# EAGLE design receiver (EAGLE 7.2.0)

## Sheet 1 of 3: Connectors and Power Supply
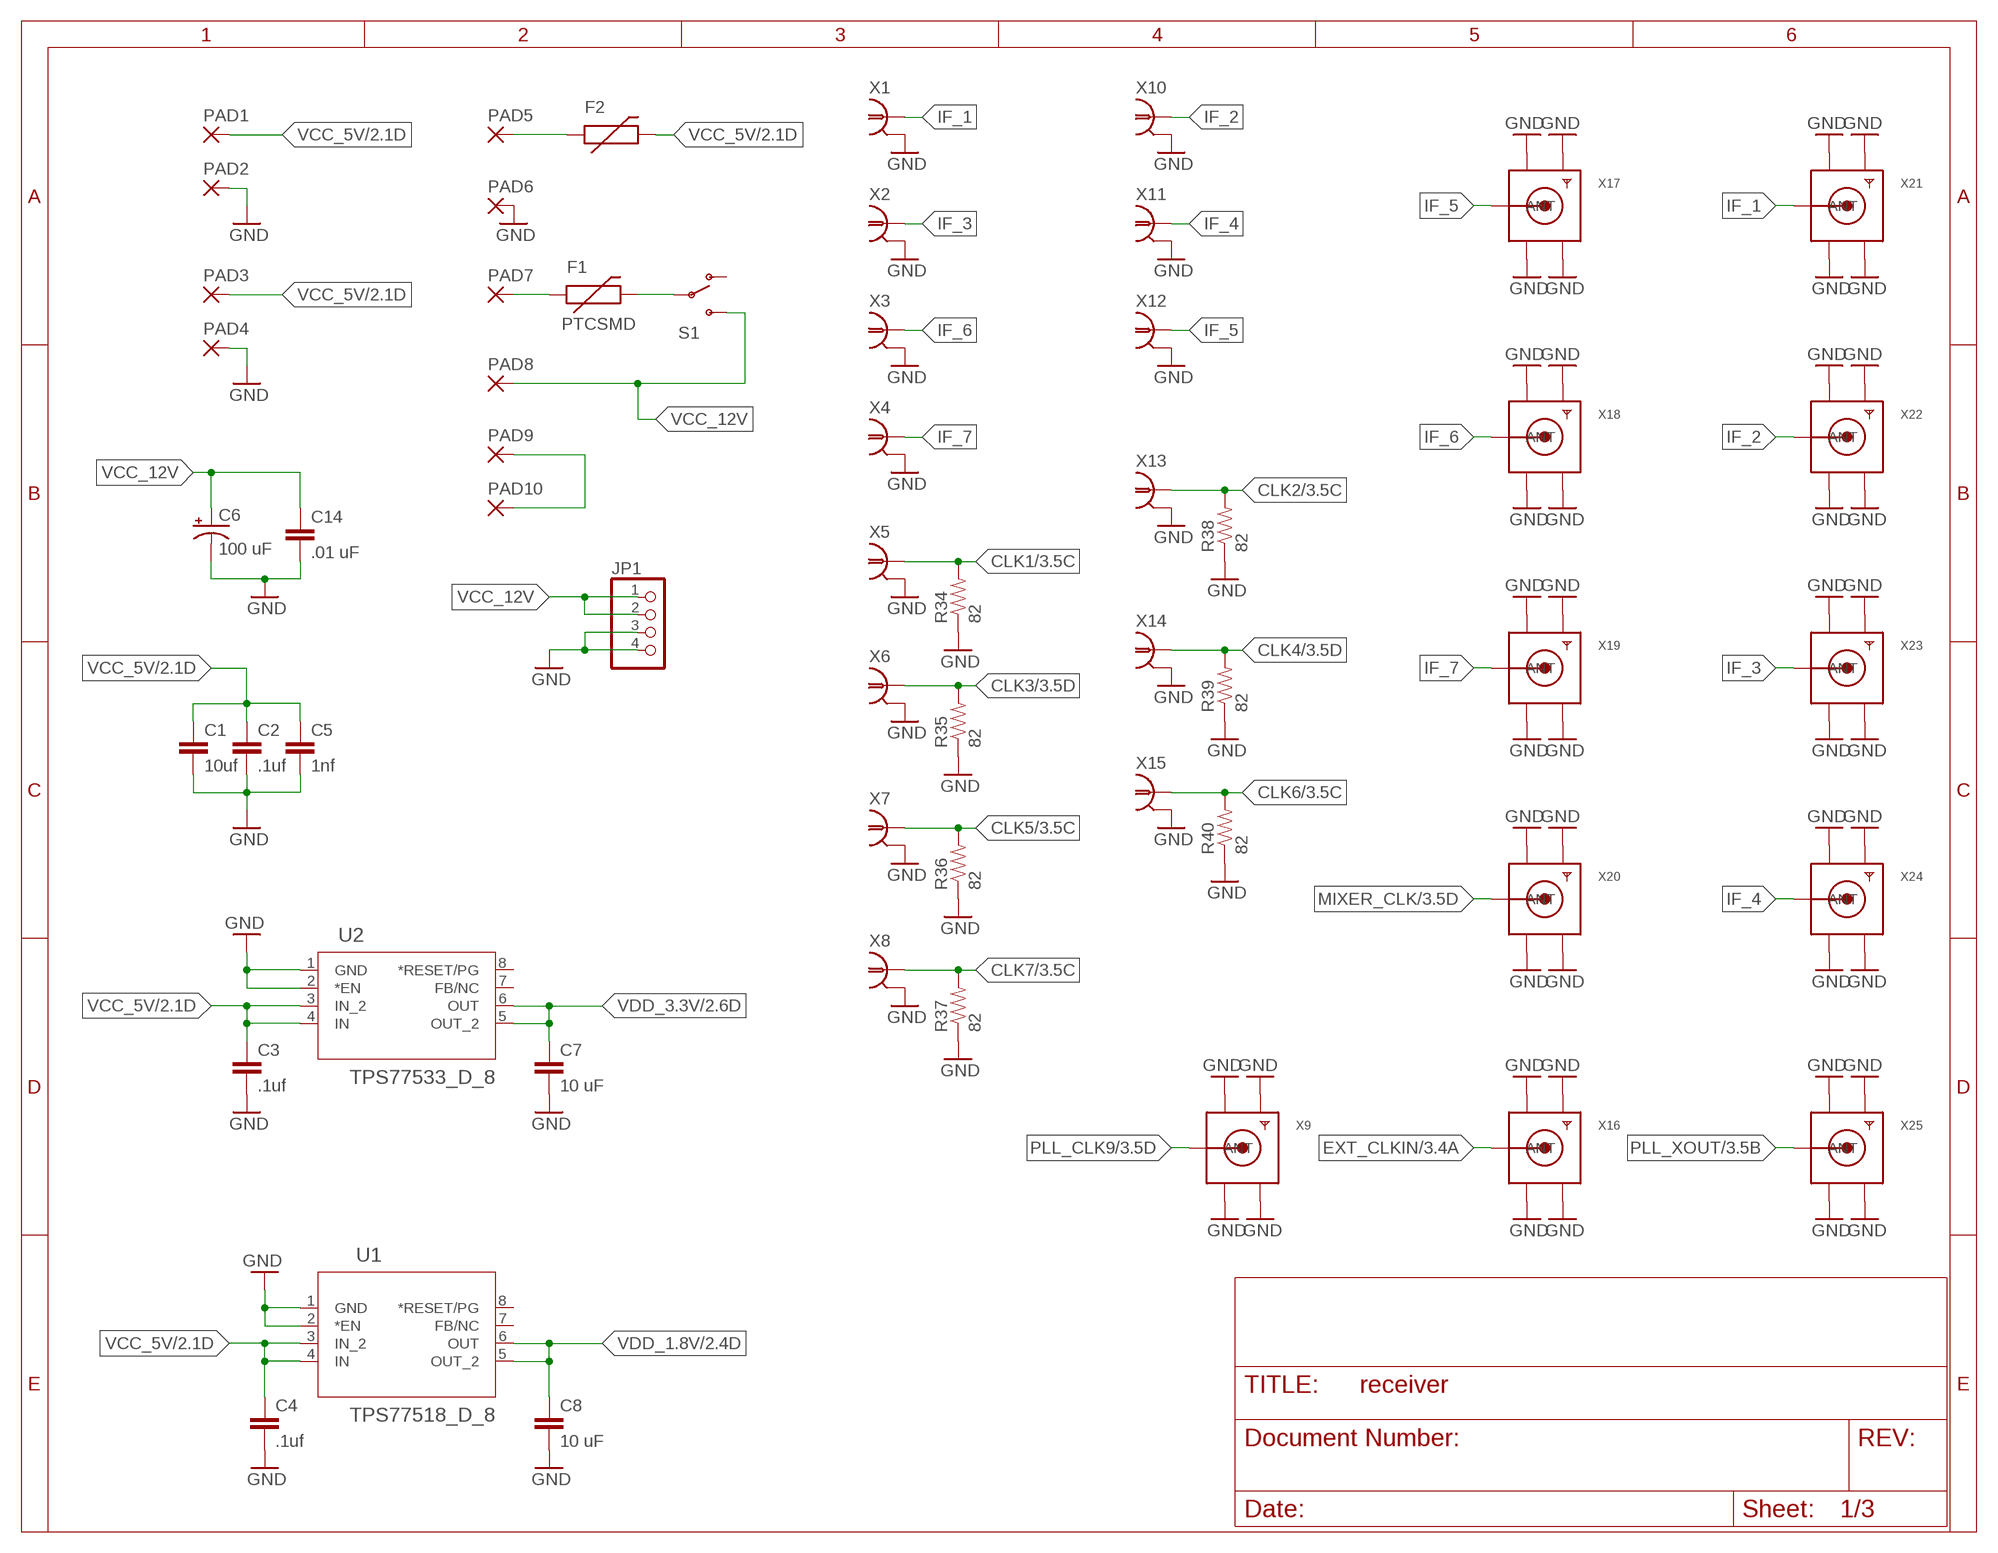
[diagram p0: schematic, sheet 1]

### Parts
C1  10uf  CAP1206  [1206]
C2  .1uf  CAP0805  [0805]
C3  .1uf  CAP0805  [0805]
C4  .1uf  CAP0805  [0805]
C5  1nf  CAP0805  [0805]
C6  100 uF  CAP_POLPTH4  [CPOL-RADIAL-1000UF-25V]
C7  10 uF  CAP1206  [1206]
C8  10 uF  CAP1206  [1206]
C14  .01 uF  CAP0805  [0805]
F1  PTCSMD  [PTC-1206]
F2  PTCSMD  [PTC-1206]
JP1  PINHD-1X4  [1X04]
PAD1  WIREPAD2,54/0,9  [2,54/0,9]
PAD2  WIREPAD2,54/0,9  [2,54/0,9]
PAD3  WIREPAD2,54/0,9  [2,54/0,9]
PAD4  WIREPAD2,54/0,9  [2,54/0,9]
PAD5  WIREPAD2,54/0,9  [2,54/0,9]
PAD6  WIREPAD2,54/0,9  [2,54/0,9]
PAD7  WIREPAD2,54/0,9  [2,54/0,9]
PAD8  WIREPAD2,54/0,9  [2,54/0,9]
PAD9  WIREPAD2,54/0,9  [2,54/0,9]
PAD10  WIREPAD2,54/0,9  [2,54/0,9]
R34  82  RESISTOR0805-RES  [0805]
R35  82  RESISTOR0805-RES  [0805]
R36  82  RESISTOR0805-RES  [0805]
R37  82  RESISTOR0805-RES  [0805]
R38  82  RESISTOR0805-RES  [0805]
R39  82  RESISTOR0805-RES  [0805]
R40  82  RESISTOR0805-RES  [0805]
S1  SWITCH-SPDTPTH  [SWITCH-SPDT]
U1  TPS77518_D_8  [D8]
U2  TPS77533_D_8  [D8]
X1  LTI-SASF54GT  [LTI-SASF54GT]
X2  LTI-SASF54GT  [LTI-SASF54GT]
X3  LTI-SASF54GT  [LTI-SASF54GT]
X4  LTI-SASF54GT  [LTI-SASF54GT]
X5  LTI-SASF54GT  [LTI-SASF54GT]
X6  LTI-SASF54GT  [LTI-SASF54GT]
X7  LTI-SASF54GT  [LTI-SASF54GT]
X8  LTI-SASF54GT  [LTI-SASF54GT]
X9  SMACONNECTOR_EDGE  [SMA_EDGELAUNCH]
X10  LTI-SASF54GT  [LTI-SASF54GT]
X11  LTI-SASF54GT  [LTI-SASF54GT]
X12  LTI-SASF54GT  [LTI-SASF54GT]
X13  LTI-SASF54GT  [LTI-SASF54GT]
X14  LTI-SASF54GT  [LTI-SASF54GT]
X15  LTI-SASF54GT  [LTI-SASF54GT]
X16  SMACONNECTOR_EDGE  [SMA_EDGELAUNCH]
X17  SMACONNECTOR_EDGE  [SMA_EDGELAUNCH]
X18  SMACONNECTOR_EDGE  [SMA_EDGELAUNCH]
X19  SMACONNECTOR_EDGE  [SMA_EDGELAUNCH]
X20  SMACONNECTOR_EDGE  [SMA_EDGELAUNCH]
X21  SMACONNECTOR_EDGE  [SMA_EDGELAUNCH]
X22  SMACONNECTOR_EDGE  [SMA_EDGELAUNCH]
X23  SMACONNECTOR_EDGE  [SMA_EDGELAUNCH]
X24  SMACONNECTOR_EDGE  [SMA_EDGELAUNCH]
X25  SMACONNECTOR_EDGE  [SMA_EDGELAUNCH]

### Nets
CLK1: R34.2 X5.1 ; also sheet 3
CLK2: R38.2 X13.1 ; also sheet 3
CLK3: R35.2 X6.1 ; also sheet 3
CLK4: R39.2 X14.1 ; also sheet 3
CLK5: R36.2 X7.1 ; also sheet 3
CLK6: R40.2 X15.1 ; also sheet 3
CLK7: R37.2 X8.1 ; also sheet 3
EXT_CLKIN: X16.P(ANT) ; also sheet 3
GND: C1.2 C2.2 C3.2 C4.2 C5.2 C6.- C7.2 C8.2 C14.2 JP1.3 JP1.4 PAD2.1(P) PAD4.1(P) PAD6.1(P) R34.1 R35.1 R36.1 R37.1 R38.1 R39.1 R40.1 U1.1(GND) U1.2(*EN) U2.1(GND) U2.2(*EN) X1.2 X1.3 X1.4 X1.5 X2.2 X2.3 X2.4 X2.5 X3.2 X3.3 X3.4 X3.5 X4.2 X4.3 X4.4 X4.5 X5.2 X5.3 X5.4 X5.5 X6.2 X6.3 X6.4 X6.5 X7.2 X7.3 X7.4 X7.5 X8.2 X8.3 X8.4 X8.5 X9.GND@1(GND4) X9.GND@2(GND3) X9.GND@3(GND2) X9.GND@4(GND1) X10.2 X10.3 X10.4 X10.5 X11.2 X11.3 X11.4 X11.5 X12.2 X12.3 X12.4 X12.5 X13.2 X13.3 X13.4 X13.5 X14.2 X14.3 X14.4 X14.5 X15.2 X15.3 X15.4 X15.5 X16.GND@1(GND4) X16.GND@2(GND3) X16.GND@3(GND2) X16.GND@4(GND1) X17.GND@1(GND4) X17.GND@2(GND3) X17.GND@3(GND2) X17.GND@4(GND1) X18.GND@1(GND4) X18.GND@2(GND3) X18.GND@3(GND2) X18.GND@4(GND1) X19.GND@1(GND4) X19.GND@2(GND3) X19.GND@3(GND2) X19.GND@4(GND1) X20.GND@1(GND4) X20.GND@2(GND3) X20.GND@3(GND2) X20.GND@4(GND1) X21.GND@1(GND4) X21.GND@2(GND3) X21.GND@3(GND2) X21.GND@4(GND1) X22.GND@1(GND4) X22.GND@2(GND3) X22.GND@3(GND2) X22.GND@4(GND1) X23.GND@1(GND4) X23.GND@2(GND3) X23.GND@3(GND2) X23.GND@4(GND1) X24.GND@1(GND4) X24.GND@2(GND3) X24.GND@3(GND2) X24.GND@4(GND1) X25.GND@1(GND4) X25.GND@2(GND3) X25.GND@3(GND2) X25.GND@4(GND1) ; also sheet 2,3
IF_1: X1.1 X21.P(ANT)
IF_2: X10.1 X22.P(ANT)
IF_3: X2.1 X23.P(ANT)
IF_4: X11.1 X24.P(ANT)
IF_5: X12.1 X17.P(ANT)
IF_6: X3.1 X18.P(ANT)
IF_7: X4.1 X19.P(ANT)
MIXER_CLK: X20.P(ANT) ; also sheet 3
N$3: F1.1 PAD7.1(P)
N$4: F1.2 S1.2(P)
N$7: F2.1 PAD5.1(P)
N$10: PAD9.1(P) PAD10.1(P)
PLL_CLK9: X9.P(ANT) ; also sheet 3
PLL_XOUT: X25.P(ANT) ; also sheet 3
VCC_5V: C1.1 C2.1 C3.1 C4.1 C5.1 F2.2 PAD1.1(P) PAD3.1(P) U1.3(IN_2) U1.4(IN) U2.3(IN_2) U2.4(IN) ; also sheet 2,3
VCC_12V: C6.+ C14.1 JP1.1 JP1.2 PAD8.1(P) S1.3(S)
VDD_1.8V: C8.1 U1.5(OUT_2) U1.6(OUT) ; also sheet 2,3
VDD_3.3V: C7.1 U2.5(OUT_2) U2.6(OUT) ; also sheet 2,3
Unconnected: S1.1(O) U1.7(FB/NC) U1.8(*RESET/PG) U2.7(FB/NC) U2.8(*RESET/PG)

## Sheet 2 of 3: GPIO, I2C Interfaces
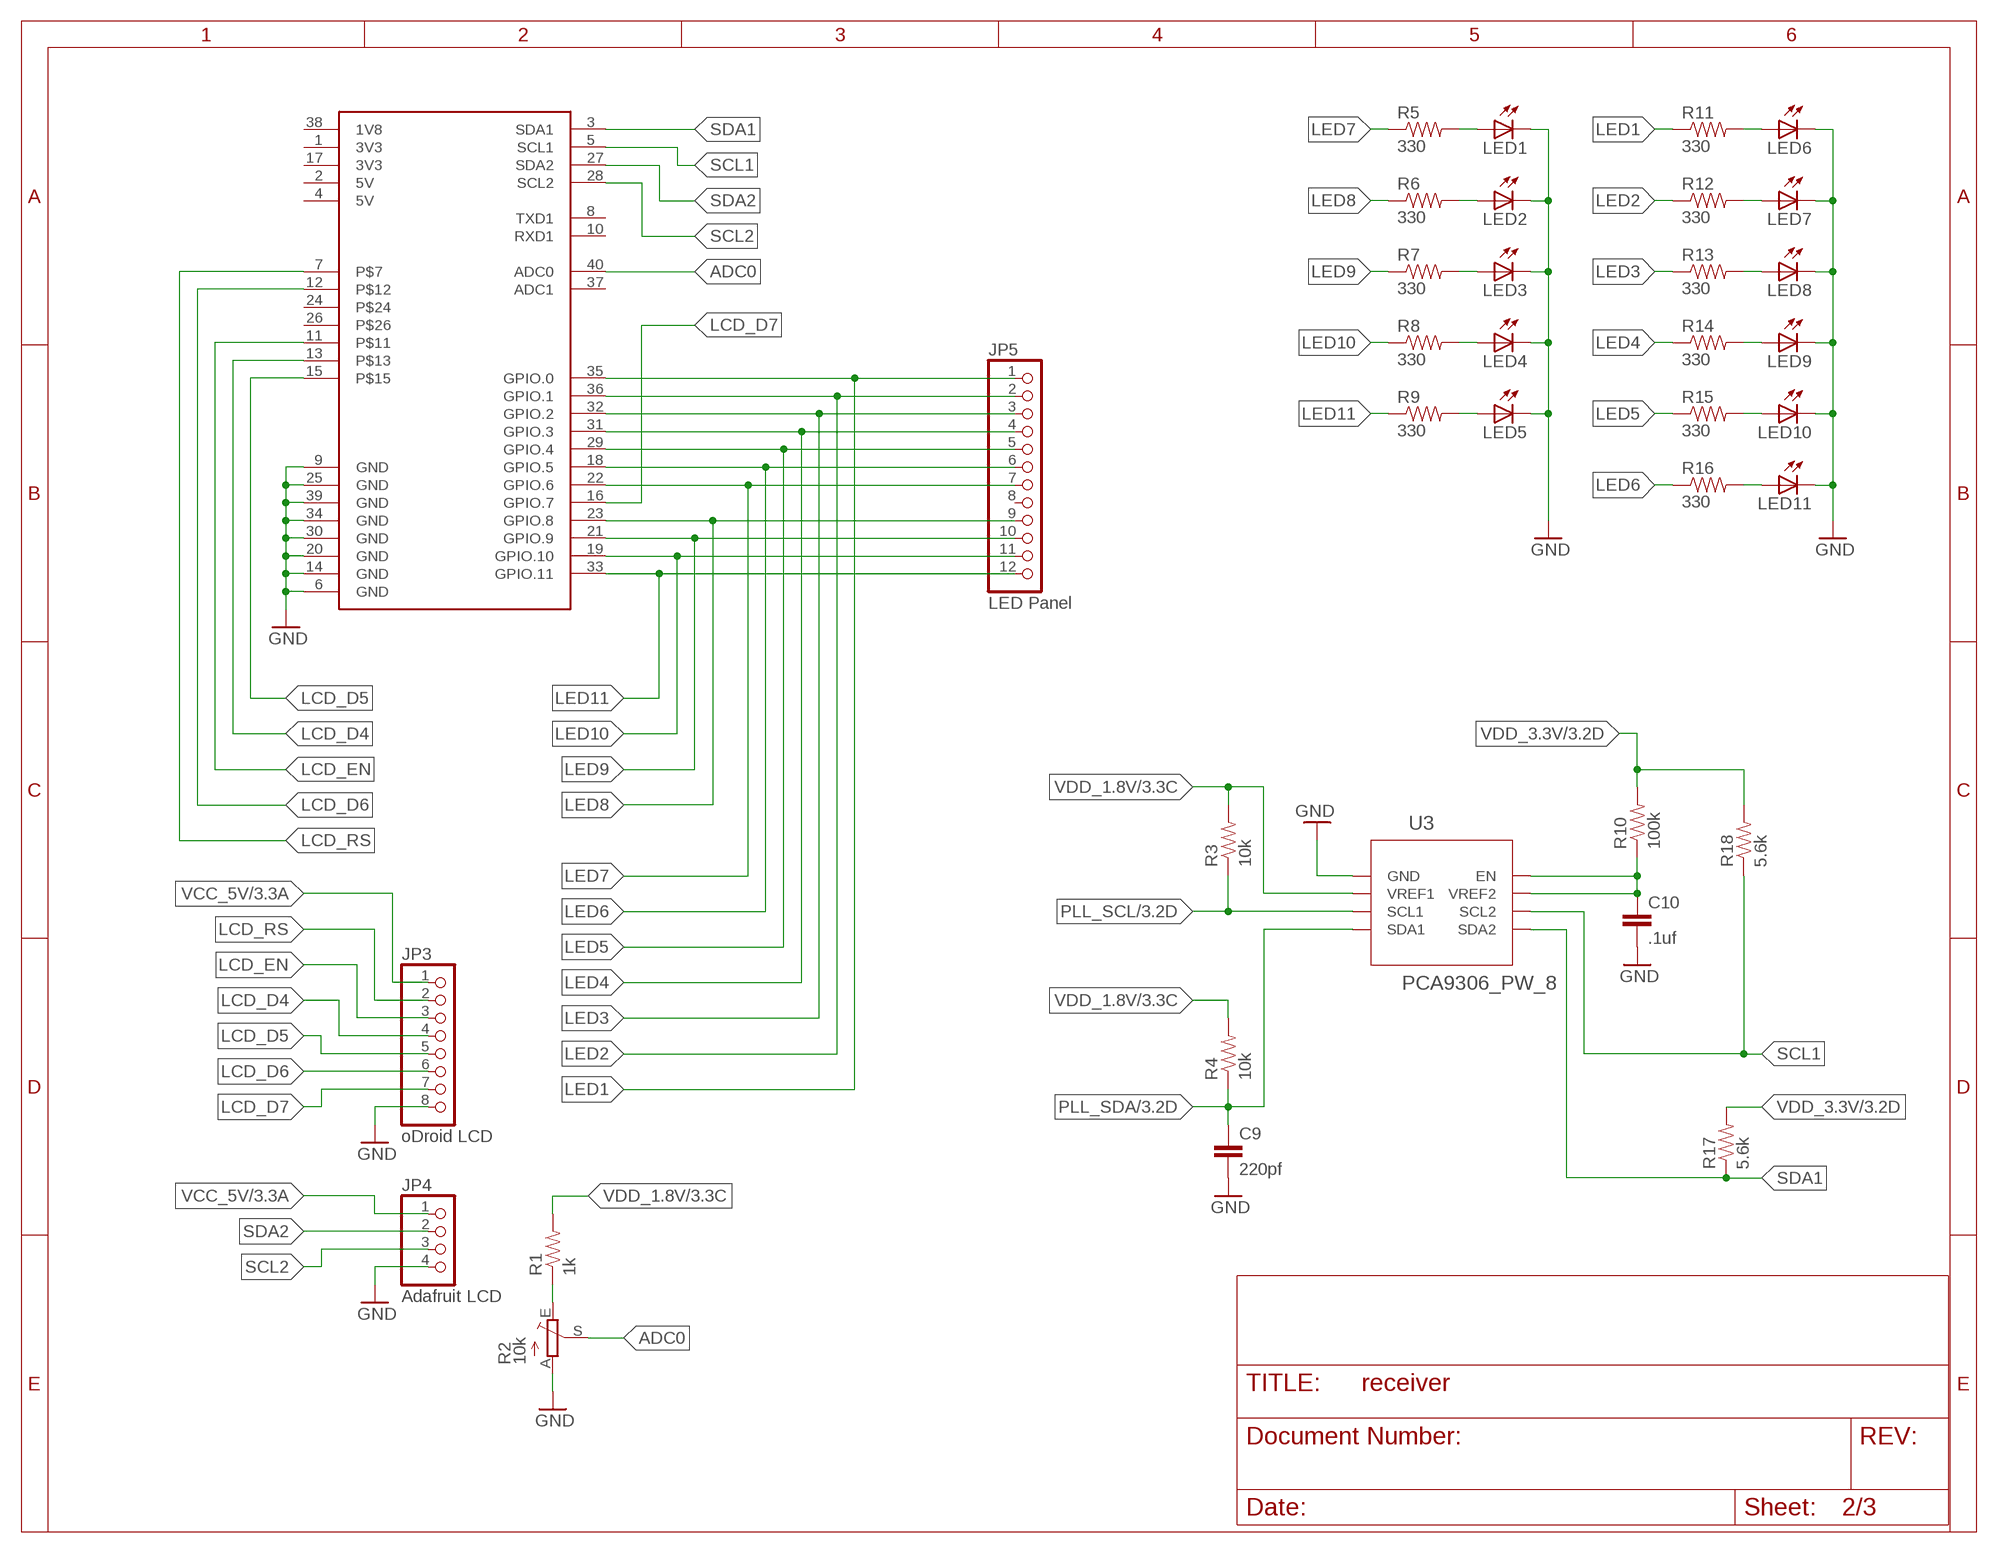
[diagram p1: schematic, sheet 2]

### Parts
C9  220pf  CAP0805  [0805]
C10  .1uf  CAP0805  [0805]
JP2  C1_GPIO  [2X20-BIG]
JP3  oDroid LCD  PINHD-1X8  [1X08]
JP4  Adafruit LCD  PINHD-1X4  [1X04]
JP5  LED Panel  PINHD-1X12  [1X12]
LED1  LEDCHIPLED_1206  [CHIPLED_1206]
LED2  LEDCHIPLED_1206  [CHIPLED_1206]
LED3  LEDCHIPLED_1206  [CHIPLED_1206]
LED4  LEDCHIPLED_1206  [CHIPLED_1206]
LED5  LEDCHIPLED_1206  [CHIPLED_1206]
LED6  LEDCHIPLED_1206  [CHIPLED_1206]
LED7  LEDCHIPLED_1206  [CHIPLED_1206]
LED8  LEDCHIPLED_1206  [CHIPLED_1206]
LED9  LEDCHIPLED_1206  [CHIPLED_1206]
LED10  LEDCHIPLED_1206  [CHIPLED_1206]
LED11  LEDCHIPLED_1206  [CHIPLED_1206]
R1  1k  RESISTOR0805-RES  [0805]
R2  10k  TRIM_EU-B64Y  [B64Y]
R3  10k  RESISTOR0805-RES  [0805]
R4  10k  RESISTOR0805-RES  [0805]
R5  330  RESISTOR0805-RES  [0805]
R6  330  RESISTOR0805-RES  [0805]
R7  330  RESISTOR0805-RES  [0805]
R8  330  RESISTOR0805-RES  [0805]
R9  330  RESISTOR0805-RES  [0805]
R10  100k  RESISTOR0805-RES  [0805]
R11  330  RESISTOR0805-RES  [0805]
R12  330  RESISTOR0805-RES  [0805]
R13  330  RESISTOR0805-RES  [0805]
R14  330  RESISTOR0805-RES  [0805]
R15  330  RESISTOR0805-RES  [0805]
R16  330  RESISTOR0805-RES  [0805]
R17  5.6k  RESISTOR0805-RES  [0805]
R18  5.6k  RESISTOR0805-RES  [0805]
U3  PCA9306_PW_8  [PW8]

### Nets
ADC0: JP2.40(ADC0) R2.S
GND: C9.2 C10.2 JP2.6(GND) JP2.9(GND) JP2.14(GND) JP2.20(GND) JP2.25(GND) JP2.30(GND) JP2.34(GND) JP2.39(GND) JP3.8 JP4.4 LED1.C LED2.C LED3.C LED4.C LED5.C LED6.C LED7.C LED8.C LED9.C LED10.C LED11.C R2.A U3.1(GND) ; also sheet 1,3
LCD_D4: JP2.13 JP3.4
LCD_D5: JP2.15 JP3.5
LCD_D6: JP2.12 JP3.6
LCD_D7: JP2.16(GPIO.7) JP3.7
LCD_EN: JP2.11 JP3.3
LCD_RS: JP2.7 JP3.2
LED1: JP2.35(GPIO.0) JP5.1 R11.1
LED2: JP2.36(GPIO.1) JP5.2 R12.1
LED3: JP2.32(GPIO.2) JP5.3 R13.1
LED4: JP2.31(GPIO.3) JP5.4 R14.1
LED5: JP2.29(GPIO.4) JP5.5 R15.1
LED6: JP2.18(GPIO.5) JP5.6 R16.1
LED7: JP2.22(GPIO.6) JP5.7 R5.1
LED8: JP2.23(GPIO.8) JP5.9 R6.1
LED9: JP2.21(GPIO.9) JP5.10 R7.1
LED10: JP2.19(GPIO.10) JP5.11 R8.1
LED11: JP2.33(GPIO.11) JP5.12 R9.1
N$2: C10.1 R10.1 U3.7(VREF2) U3.8(EN)
N$8: R1.1 R2.E
N$19: LED5.A R9.2
N$20: LED4.A R8.2
N$21: LED3.A R7.2
N$22: LED2.A R6.2
N$23: LED1.A R5.2
N$24: LED11.A R16.2
N$30: LED10.A R15.2
N$33: LED9.A R14.2
N$34: LED8.A R13.2
N$35: LED7.A R12.2
N$36: LED6.A R11.2
PLL_SCL: R3.1 U3.3(SCL1) ; also sheet 3
PLL_SDA: C9.1 R4.1 U3.4(SDA1) ; also sheet 3
SCL1: JP2.5(SCL1) R18.1 U3.6(SCL2)
SCL2: JP2.28(SCL2) JP4.3
SDA1: JP2.3(SDA1) R17.1 U3.5(SDA2)
SDA2: JP2.27(SDA2) JP4.2
VCC_5V: JP3.1 JP4.1 ; also sheet 1,3
VDD_1.8V: R1.2 R3.2 R4.2 U3.2(VREF1) ; also sheet 1,3
VDD_3.3V: R10.2 R17.2 R18.2 ; also sheet 1,3
Unconnected: JP2.1(3V3) JP2.2(5V) JP2.4(5V) JP2.8(TXD1) JP2.10(RXD1) JP2.17(3V3) JP2.24 JP2.26 JP2.37(ADC1) JP2.38(1V8) JP5.8

## Sheet 3 of 3: PLL
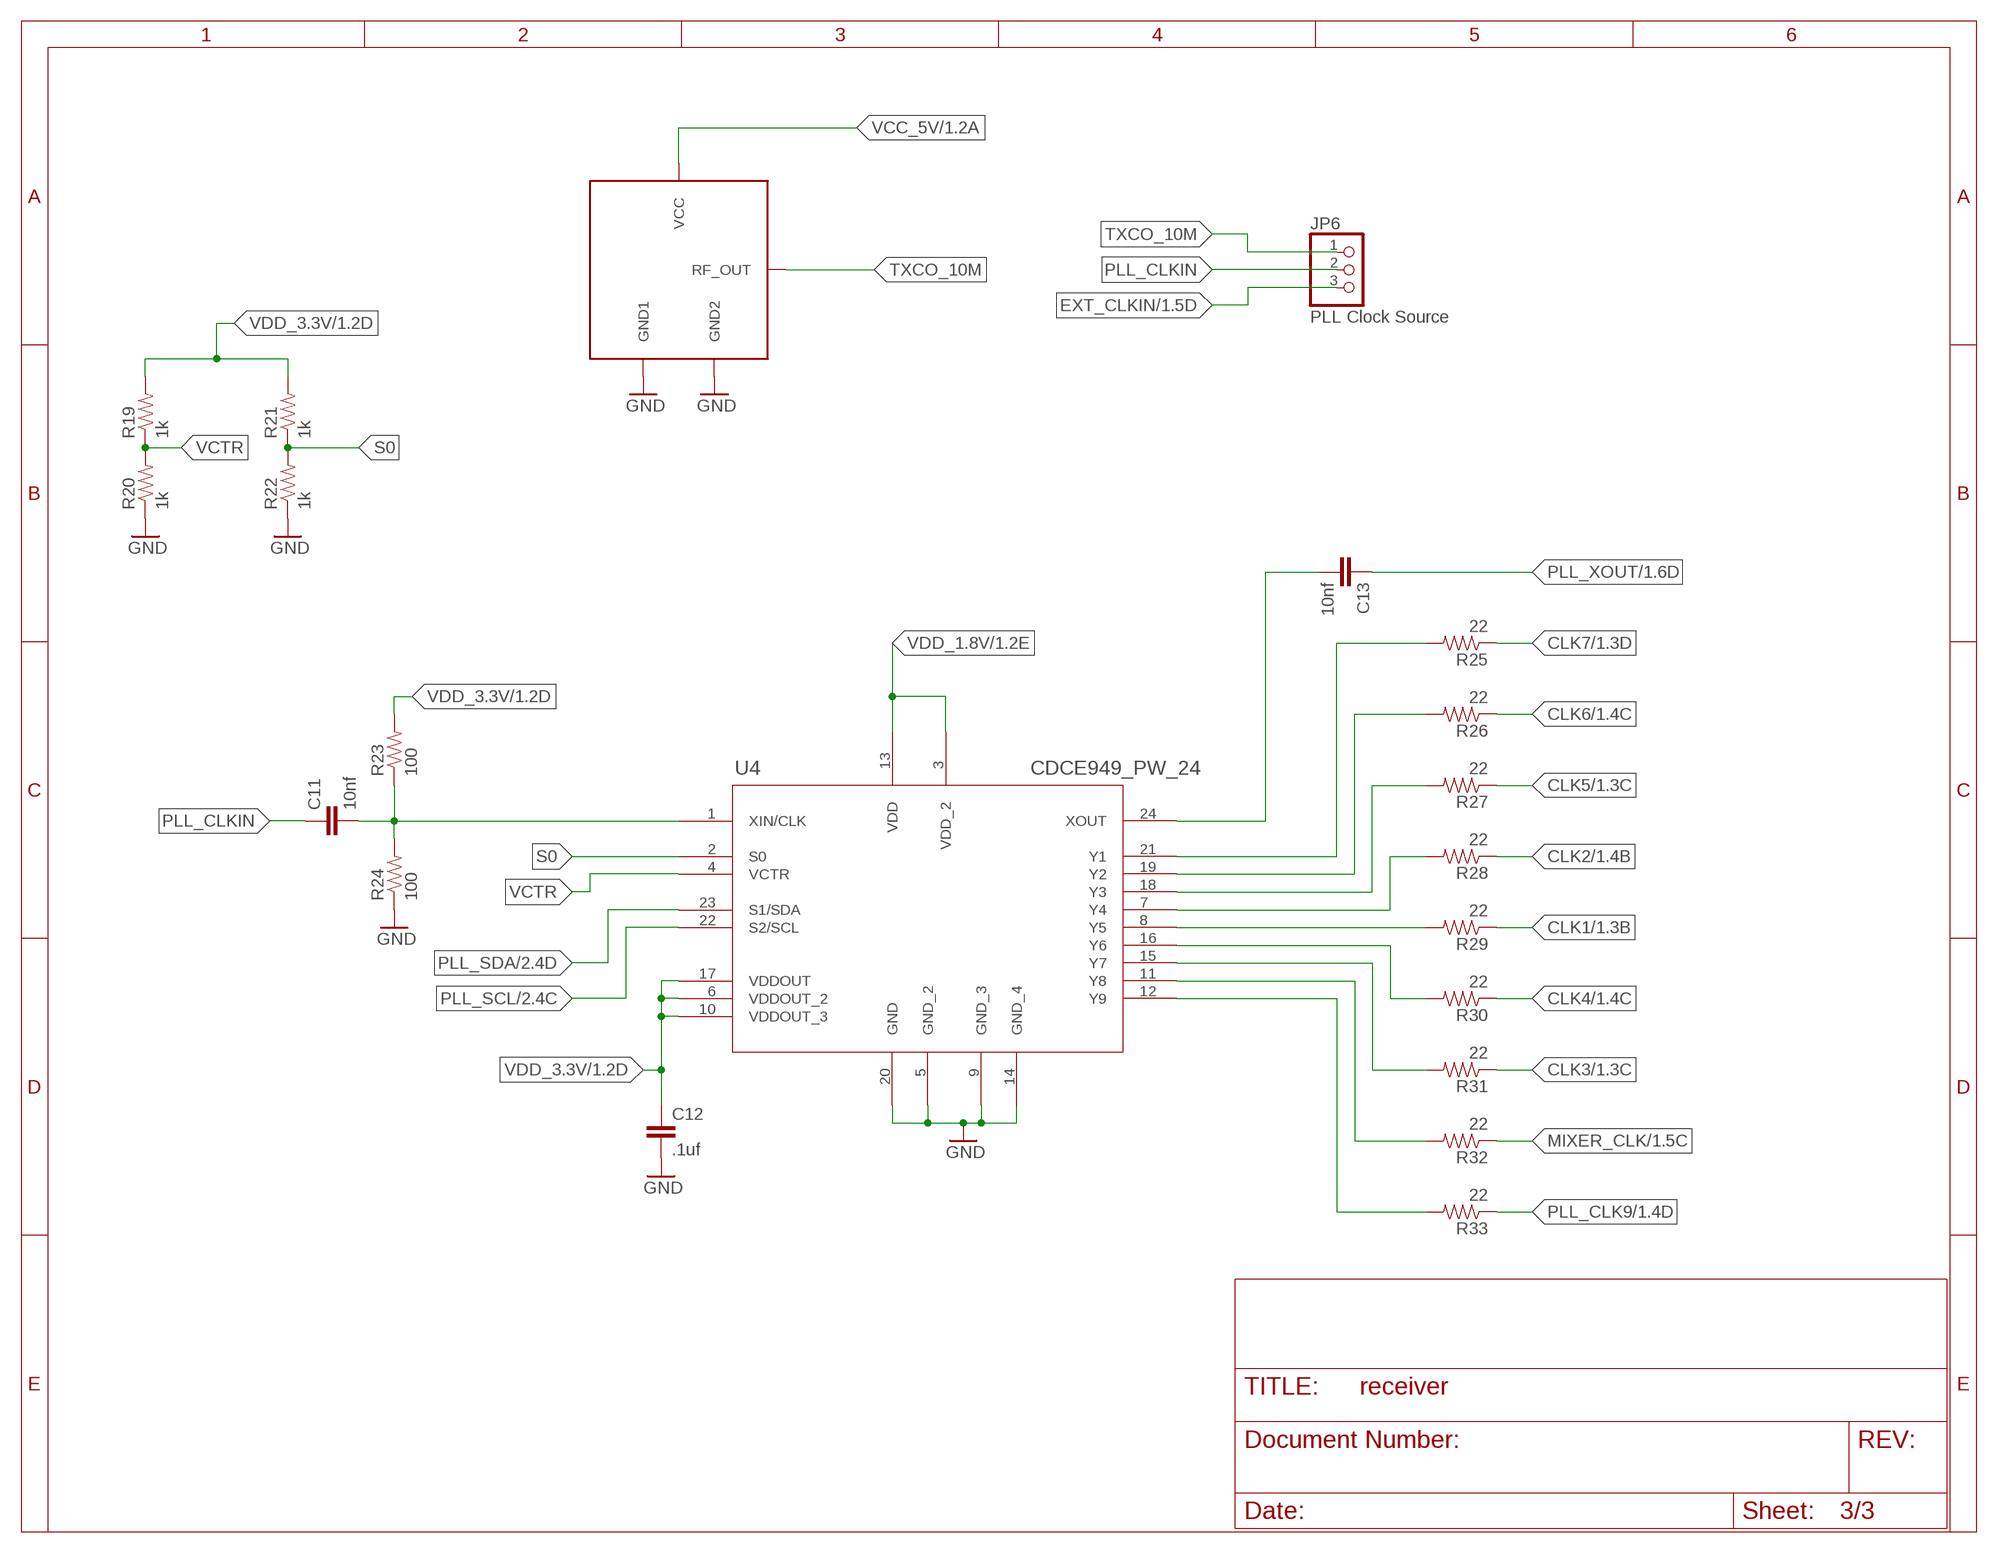
[diagram p2: schematic, sheet 3]

### Parts
$3_194_$_2015-06-18_19-54-36  TXCO 10M  TCXO-10MTHRU-HOLE  [THRU-HOLE]
C11  10nf  CAP0805  [0805]
C12  .1uf  CAP0805  [0805]
C13  10nf  CAP0805  [0805]
JP6  PLL Clock Source  PINHD-1X3  [1X03]
R19  1k  RESISTOR0805-RES  [0805]
R20  1k  RESISTOR0805-RES  [0805]
R21  1k  RESISTOR0805-RES  [0805]
R22  1k  RESISTOR0805-RES  [0805]
R23  100  RESISTOR0805-RES  [0805]
R24  100  RESISTOR0805-RES  [0805]
R25  22  RESISTOR0805-RES  [0805]
R26  22  RESISTOR0805-RES  [0805]
R27  22  RESISTOR0805-RES  [0805]
R28  22  RESISTOR0805-RES  [0805]
R29  22  RESISTOR0805-RES  [0805]
R30  22  RESISTOR0805-RES  [0805]
R31  22  RESISTOR0805-RES  [0805]
R32  22  RESISTOR0805-RES  [0805]
R33  22  RESISTOR0805-RES  [0805]
U4  CDCE949_PW_24  [PW24]

### Nets
CLK1: R29.1 ; also sheet 1
CLK2: R28.1 ; also sheet 1
CLK3: R31.1 ; also sheet 1
CLK4: R30.1 ; also sheet 1
CLK5: R27.1 ; also sheet 1
CLK6: R26.1 ; also sheet 1
CLK7: R25.1 ; also sheet 1
EXT_CLKIN: JP6.3 ; also sheet 1
GND: $3_194_$_2015-06-18_19-54-36.GND1 $3_194_$_2015-06-18_19-54-36.GND2 C12.2 R20.1 R22.1 R24.1 U4.5(GND_2) U4.9(GND_3) U4.14(GND_4) U4.20(GND) ; also sheet 1,2
MIXER_CLK: R32.1 ; also sheet 1
N$1: C11.2 R23.1 R24.2 U4.1(XIN/CLK)
N$6: C13.2 U4.24(XOUT)
N$12: R31.2 U4.15(Y7)
N$17: R25.2 U4.21(Y1)
N$25: R26.2 U4.19(Y2)
N$26: R27.2 U4.18(Y3)
N$27: R28.2 U4.7(Y4)
N$28: R29.2 U4.8(Y5)
N$29: R30.2 U4.16(Y6)
N$31: R32.2 U4.11(Y8)
N$32: R33.2 U4.12(Y9)
PLL_CLK9: R33.1 ; also sheet 1
PLL_CLKIN: C11.1 JP6.2
PLL_SCL: U4.22(S2/SCL) ; also sheet 2
PLL_SDA: U4.23(S1/SDA) ; also sheet 2
PLL_XOUT: C13.1 ; also sheet 1
S0: R21.1 R22.2 U4.2(S0)
TXCO_10M: $3_194_$_2015-06-18_19-54-36.RF_OUT JP6.1
VCC_5V: $3_194_$_2015-06-18_19-54-36.VCC ; also sheet 1,2
VCTR: R19.1 R20.2 U4.4(VCTR)
VDD_1.8V: U4.3(VDD_2) U4.13(VDD) ; also sheet 1,2
VDD_3.3V: C12.1 R19.2 R21.2 R23.2 U4.6(VDDOUT_2) U4.10(VDDOUT_3) U4.17(VDDOUT) ; also sheet 1,2

## Library data of the parts
$3_194_$_2015-06-18_19-54-36 = crystek-tcxo:TCXO-10M
C1-C5 C7-C14 = SparkFun-Capacitors:CAP: Capacitor Standard 0603 ceramic capacitor, and 0.1" leaded capacitor.
C6 = SparkFun-Capacitors:CAP_POL: Capacitor Polarized These are standard SMD and PTH capacitors. Normally 10uF, 47uF, and 100uF in electrolytic and tantalum varieties. Always verify the external diameter of the through hole cap, it varies with capacity, voltage, and manufacturer. The EIA devices should be standard.
F1 F2 = SparkFun-PowerIC:PTC: Resettable Fuse PTC Resettable Fuse. Spark Fun Electronics SKU : COM-08357; PROD_ID: RES-11150
JP1 JP4 = pinhead:PINHD-1X4: PIN HEADER
JP2 = odroid-dt:C1_GPIO
JP3 = pinhead:PINHD-1X8: PIN HEADER
JP5 = adafruit:PINHD-1X12: PIN HEADER
JP6 = pinhead:PINHD-1X3: PIN HEADER
LED1-LED11 = adafruit:LED: LED OSRAM: - CHIPLED LG R971, LG N971, LY N971, LG Q971, LY Q971, LO R971, LY R971 LH N974, LH R974 LS Q976, LO Q976, LY Q976 LO Q996 - Hyper CHIPLED LW Q18S LB Q993, LB Q99A, LB R99A - SideLED LS A670, LO A670, LY A670, LG A670, LP A670 LB A673, LV A673, LT A673, LW A673 LH A674 LY A675 LS A676, LA A676, LO A676, LY A676, LW A676 LS A679, LY A679, LG A679 - Hyper Micro SIDELED® LS Y876, LA Y876, LO Y876, LY Y876 LT Y87S - SmartLED LW L88C, LW L88S LB L89C, LB L89S, LG L890 LS L89K, LO L89K, LY L89K LS L896, LA L896, LO L896, LY L896 - TOPLED LS T670, LO T670, LY T670, LG T670, LP T670 LSG T670, LSP T670, LSY T670, LOP T670, LYG T670 LG T671, LOG T671, LSG T671 LB T673, LV T673, LT T673, LW T673 LH T674 LS T676, LA T676, LO T676, LY T676, LB T676, LH T676, LSB T676, LW T676 LB T67C, LV T67C, LT T67C, LS T67K, LO T67K, LY T67K, LW E67C LS E67B, LA E67B, LO E67B, LY E67B, LB E67C, LV E67C, LT E67C LW T67C LS T679, LY T679, LG T679 LS T770, LO T770, LY T770, LG T770, LP T770 LB T773, LV T773, LT T773, LW T773 LH T774 LS E675, LA E675, LY E675, LS T675 LS T776, LA T776, LO T776, LY T776, LB T776 LHGB T686 LT T68C, LB T68C - Hyper Mini TOPLED® LB M676 - Mini TOPLED Santana® LG M470 LS M47K, LO M47K, LY M47K Source: http://www.osram.convergy.de/
PAD1-PAD10 = wirepad:WIREPAD: Wire PAD connect wire on PCB
R1 R3-R40 = SparkFun-Passives:RESISTOR: Resistor Basic schematic elements and footprints for 0603, 1206, and PTH resistors.
R2 = pot:TRIM_EU-: POTENTIOMETER
S1 = SparkFun-Electromechanical:SWITCH-SPDT: SPDT Switch Simple slide switch, Spark Fun Electronics SKU : COM-00102 DPDT SMT slide switch, AYZ0202, SWCH-08179; PROD_ID: SWCH-08261
U1 = ti-pwr18-dt:TPS77518_D_8; DATASHEETURL: http://www.ti.com/lit/gpn/TPS77518; DESCRIPTION: Single Output LDO, 500mA, Fixed(1.8V), Fast Transient Response, SVS; FAMILY_NAME: SINGLE CHANNEL LDO; GENERIC_PART_NUMBER: TPS77518; INDUSTRY_STD_PKG_TYPE: SOIC; MANUFACTURER: Texas Instruments; MANUFACTURER_PART_NUMBER: tps77518_d_8; PACKAGE_DESIGNATOR: D; PIN_COUNT: 8; VENDOR: Texas Instruments
U2 = ti-pwr-dt:TPS77533_D_8; DATASHEETURL: http://www.ti.com/lit/gpn/TPS77533; DESCRIPTION: Single Output LDO, 500mA, Fixed(3.3V), Fast Transient Response, SVS; FAMILY_NAME: SINGLE CHANNEL LDO; GENERIC_PART_NUMBER: TPS77533; INDUSTRY_STD_PKG_TYPE: SOIC; MANUFACTURER: Texas Instruments; MANUFACTURER_PART_NUMBER: tps77533_d_8; PACKAGE_DESIGNATOR: D; PIN_COUNT: 8; VENDOR: Texas Instruments
U3 = ti-i2c:PCA9306_PW_8; DATASHEETURL: http://www.ti.com/lit/gpn/PCA9306; DESCRIPTION: Dual Bi-Directional I2C-Bus and SMBus Voltage Level-Translator; FAMILY_NAME: I2C SPECIAL FUNCTION; GENERIC_PART_NUMBER: PCA9306; INDUSTRY_STD_PKG_TYPE: TSSOP; MANUFACTURER: Texas Instruments; MANUFACTURER_PART_NUMBER: pca9306_pw_8; PACKAGE_DESIGNATOR: PW; PIN_COUNT: 8; VENDOR: Texas Instruments
U4 = ti-pll:CDCE949_PW_24; DATASHEETURL: http://www.ti.com/lit/gpn/CDCE949; DESCRIPTION: Programmable 4-PLL VCXO Clock Synthesizer with 2.5V or 3.3V LVCMOS Outputs; FAMILY_NAME: VCXO INPUT; GENERIC_PART_NUMBER: CDCE949; INDUSTRY_STD_PKG_TYPE: TSSOP; MANUFACTURER: Texas Instruments; PACKAGE_DESIGNATOR: PW; PIN_COUNT: 24
X1-X8 X10-X15 = con-coax:LTI-SASF54GT: SMA vertical PCB thrue hole jack Source: Lighthorse Technologies, inc. SASF54GT.pdf; OC_FARNELL: unknown; OC_NEWARK: unknown
X9 X16-X25 = adafruit:SMACONNECTOR: SMA Connector 90° DIP SMA Connector, 50 Ohm (4UConnector: 07259)

## Board
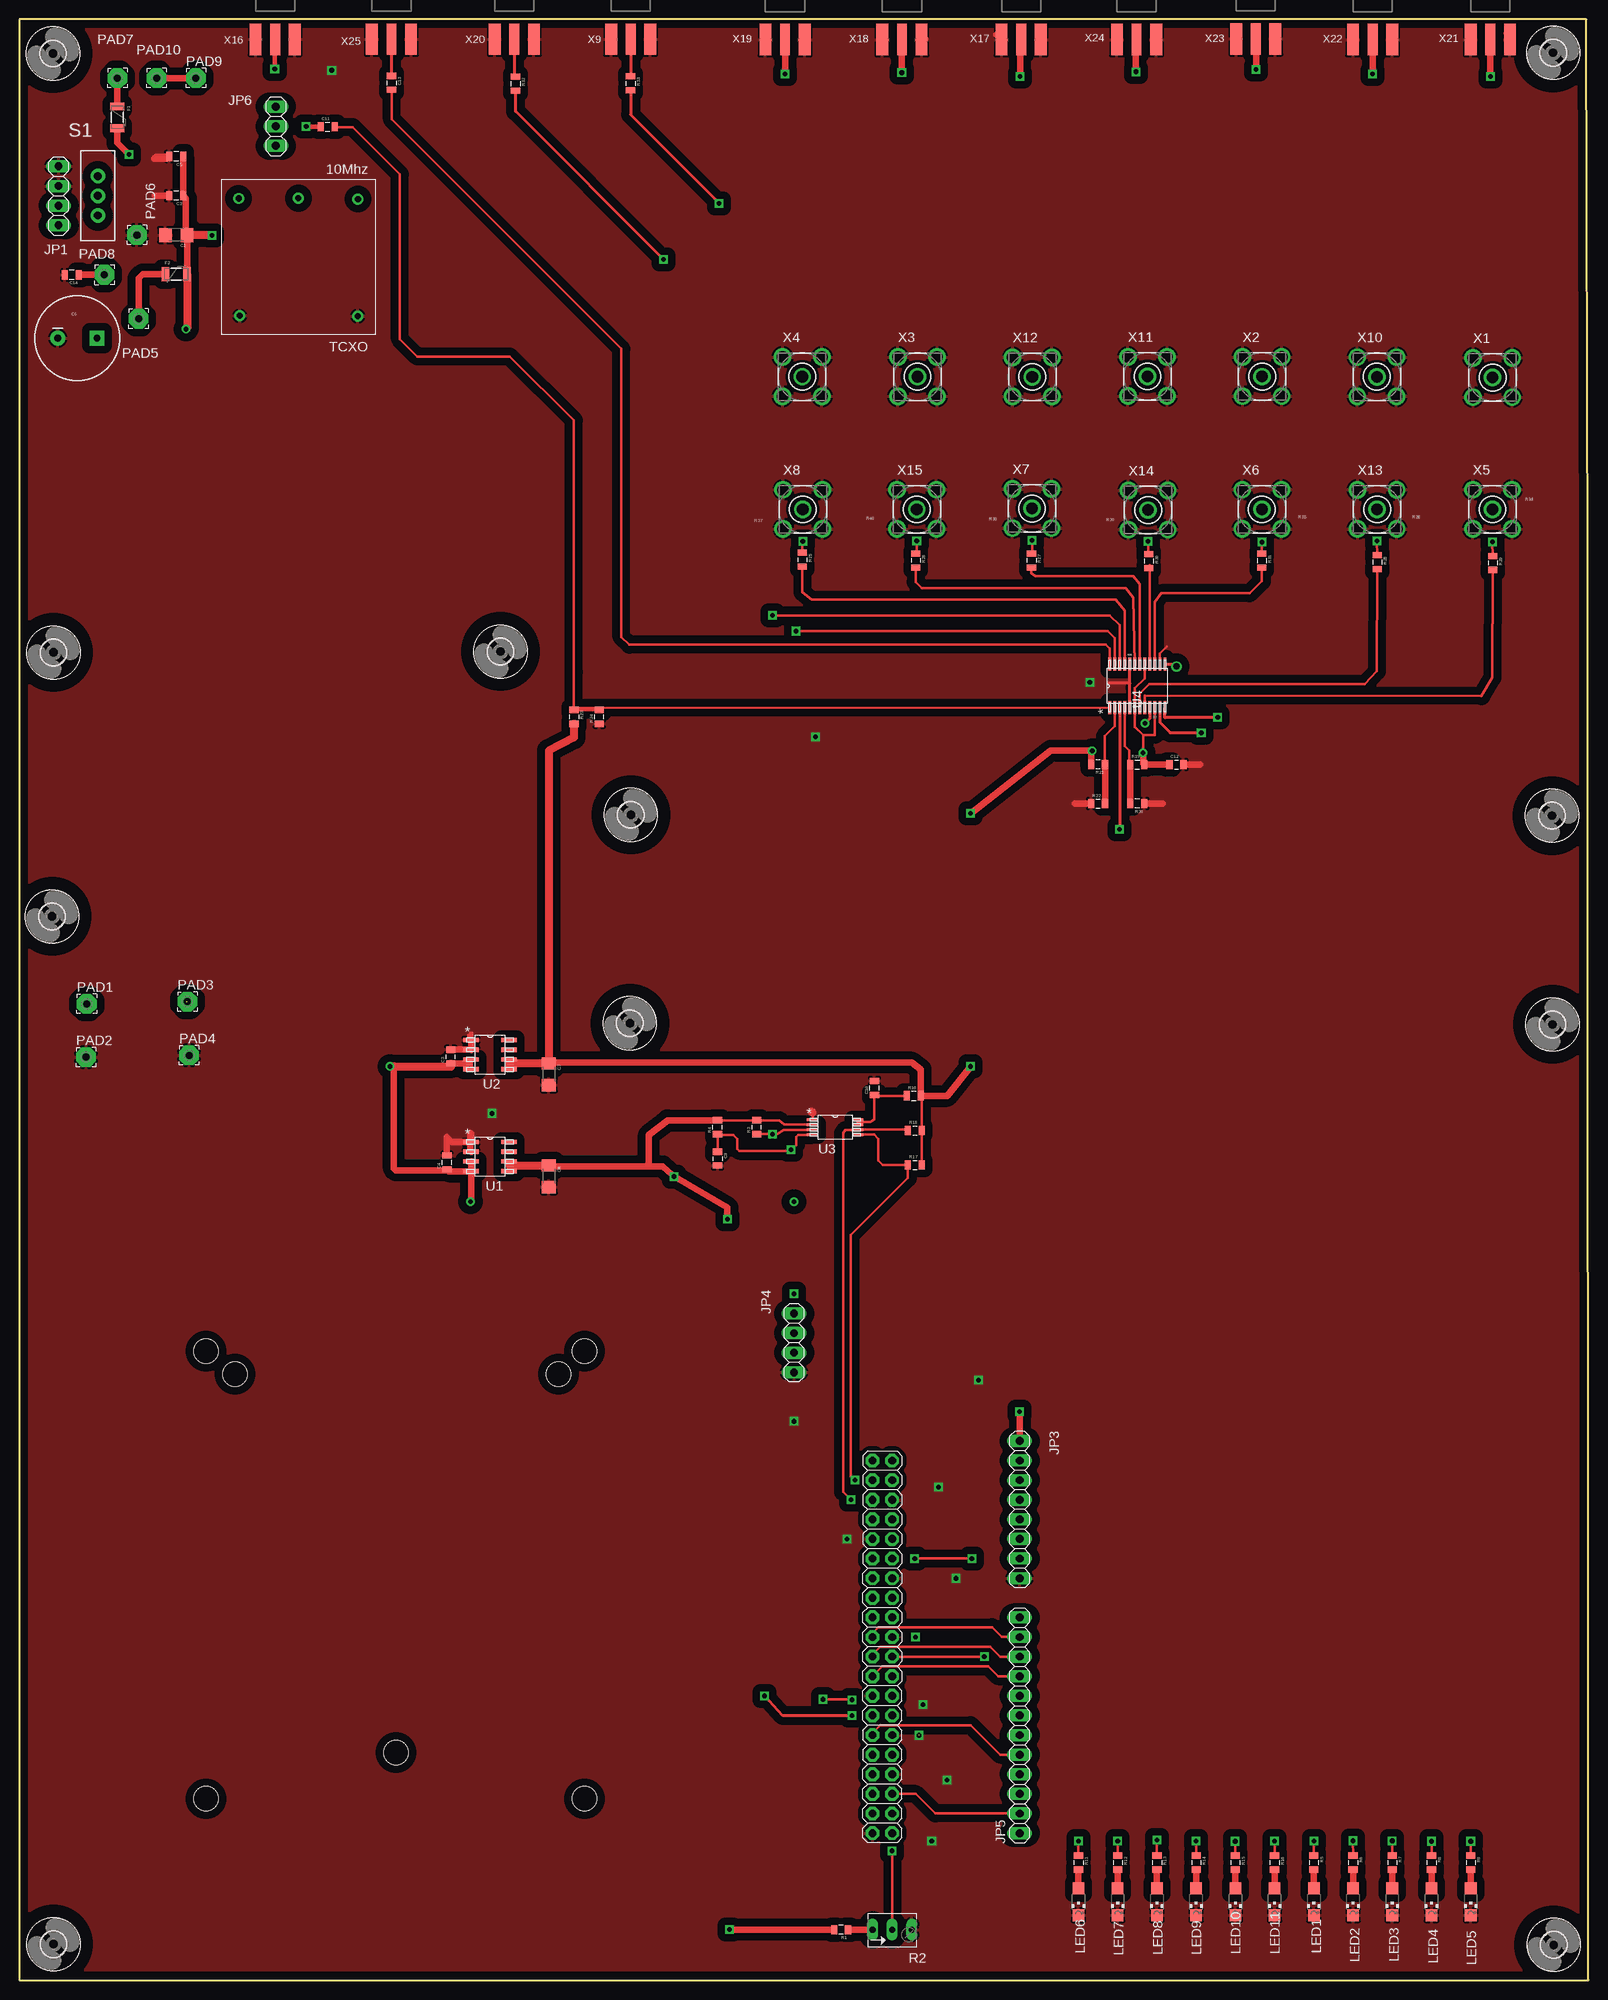
[diagram p3: board, top side]
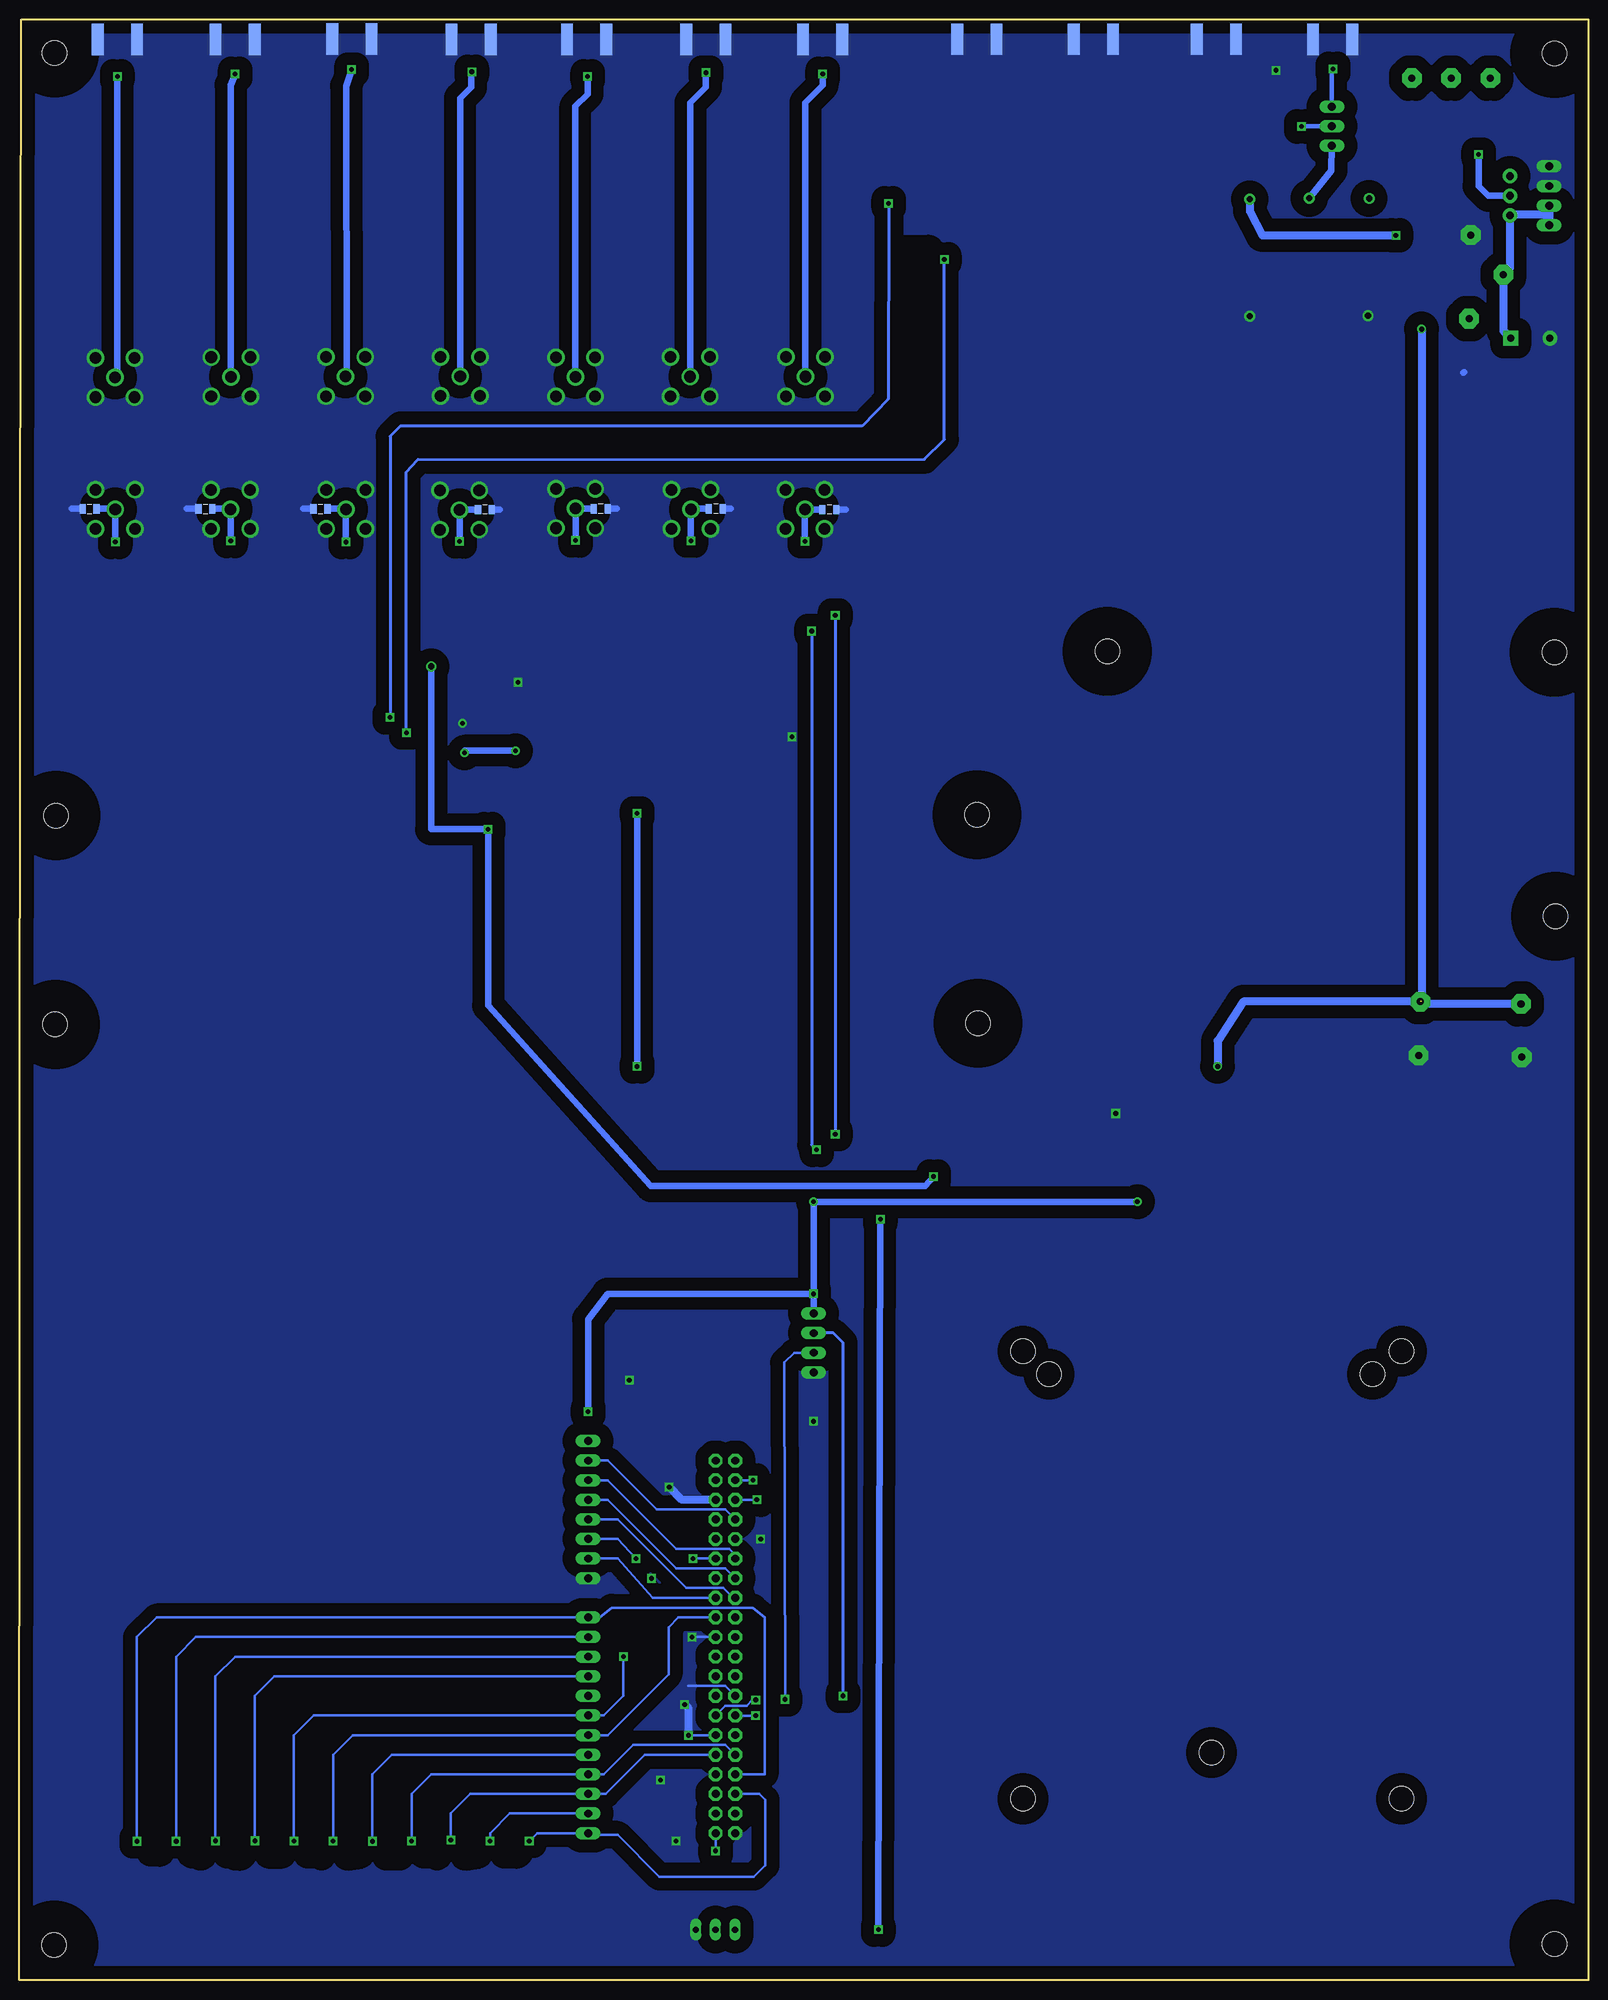
[diagram p4: board, bottom side, seen from below]

Size 203.2 x 254 mm. Coordinates in mm from the lower left corner, seen from the top.
Outline: 0,0 203.2,0 203.1,183.4 202.95,254 0,254 0,0
Copper layers (1*16): Top 0.035mm / dielectric 1.5mm / Bottom 0.035mm
Design rules "SparkFun": minimum track width 8mil, minimum drill 20mil, track to track 8mil, track to pad 8mil, pad to pad 8mil, via to via 8mil, smd to smd 8mil, copper to edge 10mil, drill to drill 8mil, minimum pad ring 12mil, minimum via ring 10mil, stop-mask expansion 4mil, vias tented up to drill 25mil, thermal gap 10mil
Holes 3.2 mm at 24.2,23.5 73.2,23.5 24.2,81.5 73.2,81.5 48.79,29.46 27.94,78.49 69.85,78.49
bRestrict: area 182.1,16.5 to 186.2,45.7; area 177.3,16 to 181.1,42.9; area 172,16 to 176.3,40.6; area 174.5,16 to 174.8,16.3; area 174.5,16.3 to 175.5,16.8; area 175.3,16 to 175.5,16.8; area 132.3,16.3 to 171.7,38.1; area 161.8,16 to 165.9,33.3; area 156.7,16 to 161.3,30.2; area 151.1,16 to 156,27.9; area 146.3,16 to 150.9,25.7; area 141.5,16 to 145.5,22.6; 3 more areas
vRestrict: area 73.2,126.6 to 199.5,147.9; area 1.6,152 to 65.2,205.4; area 12.7,0 to 85.1,97.5

### Footprints (pad centres in the part's own frame; a part is rotated, then mirrored left to right if it is on the bottom)
THRU-HOLE = drill 0.8: GND1 7.59,7.62; GND2 -7.7,7.67; NC 7.74,-7.58; RF_OUT 0,-7.62; VCC -7.71,-7.5
1206 = smd 1.6 x 1.8: 1 -1.4,0; 2 1.4,0
0805 = smd 0.8 x 1.2: 1 -0.9,0; 2 0.9,0
CPOL-RADIAL-1000UF-25V = drill 0.9 pad 1.93 square: + 2.54,0 | drill 0.9 pad 1.93: - -2.54,0
PTC-1206 = smd 1 x 1.8: 1 -1.4,0; 2 1.4,0
1X04 = drill 1.016 long: 1 -3.81,0; 2 -1.27,0; 3 1.27,0; 4 3.81,0
2X20-BIG = drill 1.016 pad 1.778 octagon: 1 -24.13,-1.27; 2 -24.13,1.27; 3 -21.59,-1.27; 4 -21.59,1.27; 5 -19.05,-1.27; 6 -19.05,1.27; 7 -16.51,-1.27; 8 -16.51,1.27; 9 -13.97,-1.27; 10 -13.97,1.27; 11 -11.43,-1.27; 12 -11.43,1.27; 13 -8.89,-1.27; 14 -8.89,1.27; 15 -6.35,-1.27; 16 -6.35,1.27; 17 -3.81,-1.27; 18 -3.81,1.27; 19 -1.27,-1.27; 20 -1.27,1.27; 21 1.27,-1.27; 22 1.27,1.27; 23 3.81,-1.27; 24 3.81,1.27; 25 6.35,-1.27; 26 6.35,1.27; 27 8.89,-1.27; 28 8.89,1.27; 29 11.43,-1.27; 30 11.43,1.27; 31 13.97,-1.27; 32 13.97,1.27; 33 16.51,-1.27; 34 16.51,1.27; 35 19.05,-1.27; 36 19.05,1.27; 37 21.59,-1.27; 38 21.59,1.27; 39 24.13,-1.27; 40 24.13,1.27
1X08 = drill 1.016 long: 1 -8.89,0; 2 -6.35,0; 3 -3.81,0; 4 -1.27,0; 5 1.27,0; 6 3.81,0; 7 6.35,0; 8 8.89,0
1X12 = drill 1.016 long: 1 -13.97,0; 2 -11.43,0; 3 -8.89,0; 4 -6.35,0; 5 -3.81,0; 6 -1.27,0; 7 1.27,0; 8 3.81,0; 9 6.35,0; 10 8.89,0; 11 11.43,0; 12 13.97,0
1X03 = drill 1.016 long: 1 -2.54,0; 2 0,0; 3 2.54,0
CHIPLED_1206 = smd 1.5 x 1.5: A 0,-1.75; C 0,1.75
2,54/0,9 = drill 0.914 pad 2.54 octagon: 1 0,0
B64Y = drill 0.813 long: A 2.54,0; E -2.54,0; S 0,0
SWITCH-SPDT = drill 1.016 pad 1.88: 1 0,2.54; 2 0,0; 3 0,-2.54
D8 = smd 1.981 x 0.559: 1 -2.464,1.905; 2 -2.464,0.635; 3 -2.464,-0.635; 4 -2.464,-1.905; 5 2.464,-1.905; 6 2.464,-0.635; 7 2.464,0.635; 8 2.464,1.905
PW8 = smd 1.473 x 0.356: 1 -2.921,0.975; 2 -2.921,0.325; 3 -2.921,-0.325; 4 -2.921,-0.975; 5 2.921,-0.975; 6 2.921,-0.325; 7 2.921,0.325; 8 2.921,0.975
PW24 = smd 1.676 x 0.356: 1 -2.819,3.575; 2 -2.819,2.925; 3 -2.819,2.275; 4 -2.819,1.625; 5 -2.819,0.975; 6 -2.819,0.325; 7 -2.819,-0.325; 8 -2.819,-0.975; 9 -2.819,-1.625; 10 -2.819,-2.275; 11 -2.819,-2.925; 12 -2.819,-3.575; 13 2.819,-3.575; 14 2.819,-2.925; 15 2.819,-2.275; 16 2.819,-1.625; 17 2.819,-0.975; 18 2.819,-0.325; 19 2.819,0.325; 20 2.819,0.975; 21 2.819,1.625; 22 2.819,2.275; 23 2.819,2.925; 24 2.819,3.575
3,2 = hole 3.2: 0,0
LTI-SASF54GT = drill 1.5 pad 2.2: 1 0,0; 2 -2.54,2.54; 3 2.54,2.54; 4 2.54,-2.54; 5 -2.54,-2.54
SMA_EDGELAUNCH = smd 4.064 x 1.524: GND@1 2.032,-2.54; GND@2 2.032,2.54 | smd 4.064 x 1.524 bottom: GND@3 2.032,2.54; GND@4 2.032,-2.54 | smd 4.064 x 1.27: P 2.032,0

### Placement (x,y rotation side)
$3_194_$_2015-06-18_19-54-36  36.14,223.21 180 top
C1  20.32,226.06 180 top
C2  20.32,231.14 180 top
C3  55.88,119.63 90 top
C4  55.37,105.92 90 top
C5  20.32,236.22 180 top
C6  7.52,212.7 0 top
C7  68.58,117.35 270 top
C8  68.58,104.14 270 top
C9  90.42,106.43 270 top
C10  110.74,115.57 90 top
C11  39.93,240.08 0 top
C12  149.86,157.48 0 top
C13  48.21,245.76 270 top
C14  6.8,220.9 180 top
F1  12.7,241.3 270 top
F2  20.32,220.98 0 top
JP1  5.08,231.14 90 top
JP2  111.76,43.18 270 top
JP3  129.54,60.96 270 top
JP4  100.33,82.55 270 top
JP5  129.54,33.02 90 top
JP6  33.22,240.15 90 top
LED1  167.64,10.16 180 top
LED2  172.72,10.16 180 top
LED3  177.8,10.16 180 top
LED4  182.88,10.16 180 top
LED5  187.96,10.16 180 top
LED6  137.16,10.16 180 top
LED7  142.24,10.16 180 top
LED8  147.32,10.16 180 top
LED9  152.4,10.16 180 top
LED10  157.48,10.16 180 top
LED11  162.56,10.16 180 top
PAD1  8.73,126.47 0 top
PAD2  8.64,119.57 0 top
PAD3  21.76,126.76 0 top
PAD4  21.98,119.8 0 top
PAD5  15.46,215.22 0 top
PAD6  15.24,226.06 0 top
PAD7  12.7,246.38 0 top
PAD8  11.02,220.92 90 top
PAD9  22.86,246.38 0 top
PAD10  17.78,246.38 0 top
R1  106.43,6.54 180 top
R2  113.05,6.54 0 top
R3  95.5,110.49 90 top
R4  90.42,110.49 90 top
R5  167.64,15.24 270 top
R6  172.72,15.24 270 top
R7  177.8,15.24 270 top
R8  182.88,15.24 270 top
R9  187.96,15.24 270 top
R10  115.82,114.55 0 top
R11  137.16,15.24 270 top
R12  142.24,15.24 270 top
R13  147.32,15.24 270 top
R14  152.4,15.24 270 top
R15  157.48,15.24 270 top
R16  162.56,15.24 270 top
R17  115.97,105.61 0 top
R18  115.97,110.08 0 top
R19  144.78,157.48 0 top
R20  144.78,152.4 180 top
R21  139.7,157.48 180 top
R22  139.7,152.4 0 top
R23  71.82,163.65 270 top
R24  75.12,163.65 90 top
R25  101.4,184 270 top
R26  116.08,183.9 270 top
R27  131.06,183.9 270 top
R28  175.84,183.69 270 top
R29  190.8,183.58 270 top
R30  146.28,183.81 270 top
R31  160.91,183.88 270 top
R32  64.25,245.66 270 top
R33  79.15,245.71 270 top
R34  194.1,190.6 0 bottom
R35  164.2,190.6 0 bottom
R36  127.9,190.6 180 bottom
R37  98.3,190.5 180 bottom
R38  179.1,190.6 0 bottom
R39  142.9,190.5 180 bottom
R40  113,190.6 180 bottom
S1  10.16,231.14 0 top
U1  60.96,106.68 0 top
U2  60.96,119.89 0 top
U3  105.66,110.49 0 top
U4  144.78,167.64 90 top
U$2  [3,2]  198.7,4.57 0 top
U$3  [3,2]  4.42,4.67 0 top
U$4  [3,2]  79.2,150.95 0 top
U$5  [3,2]  79.07,123.95 0 top
U$6  [3,2]  198.55,123.8 0 top
U$7  [3,2]  198.48,150.85 0 top
U$8  [3,2]  62.31,172.11 0 top
U$9  [3,2]  4.42,171.98 0 top
U$13  [3,2]  4.37,249.58 0 top
U$14  [3,2]  198.63,249.66 0 top
U$15  [3,2]  4.24,137.79 0 top
X1  190.8,207.6 0 top
X2  160.94,207.72 0 top
X3  116.32,207.71 0 top
X4  101.39,207.71 0 top
X5  190.77,190.53 0 top
X6  160.91,190.53 0 top
X7  131.15,190.63 0 top
X8  101.46,190.53 0 top
X9  79.18,253.45 270 top
X10  175.8,207.7 0 top
X11  146.1,207.74 0 top
X12  131.18,207.68 0 top
X13  175.84,190.52 0 top
X14  146.18,190.43 0 top
X15  116.22,190.53 0 top
X16  33.14,253.44 270 top
X17  129.74,253.4 270 top
X18  114.3,253.4 270 top
X19  99.16,253.4 270 top
X20  64.1,253.45 270 top
X21  190.5,253.4 270 top
X22  175.26,253.4 270 top
X23  160.12,253.5 270 top
X24  144.68,253.4 270 top
X25  48.19,253.45 270 top

### Tracks (layer width: path | path; a pad name or v marks a point on that pad's centre or on a via)
ADC0  (via drill 0.6 pad 1.01)
  Top 0.305: v113.03,16.76 R2.S
  Bottom 0.305: JP2.40 v113.03,16.76
CLK1  (via drill 0.6 pad 1.01)
  Top 0.254: 190.8,184.5 R29.1
  Top 0.305: v190.77,186.29 R29.1
  Bottom 0.813: v190.77,186.29 X5.1 190.84,190.6 R34.2
CLK2  (via drill 0.6 pad 1.01)
  Top 0.305: v175.81,186.42 R28.1 | 175.84,184.4 R28.1 | 175.75,184.5 R28.1
  Bottom 0.813: v175.81,186.42 X13.1 175.92,190.6 R38.2
CLK3  (via drill 0.6 pad 1.01)
  Top 0.305: 160.89,184.8 R31.1 v160.91,186.28
  Bottom 0.813: v160.91,186.28 X6.1 160.98,190.6 R35.2
CLK4  (via drill 0.6 pad 1.01)
  Top 0.305: v146.18,186.36 146.18,184.84 146.25,184.89 146.23,184.89 146.23,184.71 R30.1 146.17,184.6
  Bottom 0.813: v146.18,186.36 X14.1 146.11,190.5 R39.2
CLK5  (via drill 0.6 pad 1.01)
  Top 0.305: v131.15,186.49 131.15,184.88 R27.1 130.97,184.7
  Bottom 0.813: v131.15,186.49 X7.1 131.12,190.6 R36.2
CLK6  (via drill 0.6 pad 1.01)
  Top 0.305: v116.22,186.46 116.22,184.94 R26.1 115.98,184.7
  Bottom 0.813: v116.22,186.46 X15.1 116.15,190.6 R40.2
CLK7  (via drill 0.6 pad 1.01)
  Top 0.254: R25.1 101.5,184.9
  Top 0.305: R25.1 101.4,186.33 v101.46,186.39
  Bottom 0.813: v101.46,186.39 X8.1 101.43,190.5 R37.2
EXT_CLKIN  (via drill 0.6 pad 1.01)
  Top 0.61: v33.08,247.57 33.08,251.95
  Top 1.016: 33.08,251.95 X16.P
  Bottom 0.61: JP6.3 33.22,247.43
  Bottom 0.813: 33.22,247.43 v33.08,247.57
  Bottom 1.016: v33.08,247.57 33.12,247.57
GND  (via drill 0.6, 0.6 pad 1.01)  (1 unrouted)
  Top 0.305: 58.48,120.53 U2.2 58.42,122.43 | 58.42,122.43 58.42,122.68 | 58.42,122.43 58.42,121.41 58.67,121.67 58.67,122.68 | 58.67,122.68 58.17,122.17 58.17,122.43 58.42,122.68 | 58.42,122.68 58.67,122.68 | U3.1 102.74,112.39 | U4.14 147.71,171.84 148.59,172.72
  Top 0.406: U4.9 146.41,163.42 v145.8,162.81 | U4.20 U4.5 143.81,165.46 143.81,168 141,168
  Top 0.813: C5.2 19.3,236.22 | 19.3,236.22 17.78,236.22 17.5,235.97 19.02,235.97 19.3,236.22 | C2.2 17.53,231.14 | X18.GND@4 111.51,251.97 | 126.49,251.97 127,251.46 | 117.35,251.46 117.09,251.21 117.09,252.22 | X18.GND@3 116.84,251.46 | 132.33,251.97 X17.GND@3 132.59,251.97 | X24.GND@3 147.32,251.71 147.57,251.46 | 157.23,252.22 X23.GND@4 | 192.61,252.22 192.89,252.04 192.91,252.15 193.01,252.4 | C12.2 152.91,157.48 | R20.1 148.08,152.4 | R22.1 136.65,152.4 | C3.2 58.48,120.53 | U2.2 U2.1 | C4.2 55.37,109.22 56.01,108.58 U1.1 58.5,109.65 58.42,109.73 58.42,107.39 U1.2
  Top 1.016: 102.74,112.39 102.62,112.52
  Bottom 0.305: JP2.20 v116.08,44.45 | JP2.30 116.51,31.73 | JP2.25 111.76,38.1 116.59,38.1
  Bottom 0.813: 16.1,208.3 16.2,208.2 | R37.1 96.2,190.5 | R40.1 111.1,190.6 | R36.1 125.8,190.6 | R39.1 141,190.5 | R35.1 166.4,190.6 | R38.1 181.5,190.6 | R34.1 196.4,190.6
  Bottom 1.016: JP2.6 117.4,62.23 v119.04,63.87 | v116.52,31.72 116.52,35.2 v117.03,35.71
  other vias: 100.33,72.39 124.21,77.72 103.12,161.04 61.21,112.27 107.19,57.15 121.32,52.05 120.14,25.91 40.46,247.4 118.16,18.04 138.63,168.11
  pour Top (isolate 1.778): 0,0 203.2,0 203.2,254 0,254
  pour Top (isolate 1.016): 0,0 203.2,0 203.2,254 0,254
  pour Bottom (isolate 1.676, no thermals): 0,0 203.2,0 203.2,254 0,254
IF_1  (via drill 0.6 pad 1.01)
  Top 0.813: X21.P v190.5,246.6
  Bottom 0.813: v190.5,246.6 190.5,207.9 X1.1
IF_2  (via drill 0.6 pad 1.01)
  Top 0.813: X22.P v175.26,246.91
  Bottom 0.813: v175.26,246.91 175.82,245.47 175.82,207.72 X10.1
IF_3  (via drill 0.6 pad 1.01)
  Top 0.813: X23.P v160.17,247.49
  Bottom 0.813: v160.17,247.49 160.88,245.33 160.78,207.88 X2.1
IF_4  (via drill 0.6 pad 1.01)
  Top 0.61: 144.6,251.79 X24.P
  Top 0.813: v144.6,247.2 144.6,251.79
  Bottom 0.61: 144.7,247.1 v144.6,247.2
  Bottom 0.813: X11.1 146.1,243.8 144.7,245.2 144.7,247.1
IF_5  (via drill 0.6 pad 1.01)
  Top 0.61: 129.6,251.91 X17.P
  Top 0.813: v129.6,246.6 129.6,251.91
  Bottom 0.813: X12.1 131.18,242.72 129.6,244.3 v129.6,246.6
IF_6  (via drill 0.6 pad 1.01)
  Top 0.813: X18.P v114.28,247.08
  Bottom 0.61: 116.3,207.73 X3.1
  Bottom 0.813: v114.28,247.08 114.28,245.22 116.3,243.2 116.3,207.73
IF_7  (via drill 0.6 pad 1.01)
  Top 0.813: X19.P v99.16,246.91
  Bottom 0.61: X4.1
  Bottom 0.813: v99.16,246.91 99.16,245.44 101.4,243.2 X4.1
LCD_D4
  Bottom 0.305: JP2.13 111.76,53.34 118.11,53.34 127,62.23 JP3.4
LCD_D5
  Bottom 0.305: JP2.15 110.74,49.53 112.01,50.8 116.84,50.8 125.73,59.69 JP3.5
LCD_D6  (via drill 0.6 pad 1.01)
  Top 0.305: v115.96,54.61 v123.35,54.62
  Bottom 0.305: JP2.12 v115.96,54.61 | v123.35,54.62 125.73,57.15 JP3.6
LCD_D7
  Bottom 0.305: JP2.16 121.16,49.53 125.73,54.61 JP3.7
LCD_EN
  Bottom 0.305: 110.49,55.12 111.25,55.88 118.11,55.88 127,64.77 JP3.3
  Bottom 0.406: JP2.11 110.49,55.12
LCD_RS
  Bottom 0.305: JP2.7 111.76,60.96 120.65,60.96 127,67.31 JP3.2
LED1  (via drill 0.6 pad 1.01)
  Top 0.305: v137.16,18.03 R11.1
  Bottom 0.305: JP2.35 107.35,24.13 106.6,23.38 106.6,14.87 108.06,13.41 120.31,13.41 125.73,18.83 129.32,18.83 | JP5.1 136.14,19.05 v137.16,18.03
  Bottom 1.016: 129.32,18.83 JP5.1
LED2  (via drill 0.6 pad 1.01)
  Top 0.305: v142.24,18.03 R12.1 | JP5.2 118.62,21.59 116.08,24.13 JP2.36
  Bottom 0.305: JP5.2 139.7,21.59 142.24,19.05 v142.24,18.03
LED3  (via drill 0.6 pad 1.01)
  Top 0.305: v147.32,18.15 R13.1
  Bottom 0.305: JP2.32 122.17,29.21 127.25,24.13 JP5.3 144.78,24.13 147.32,21.59 v147.32,18.15
LED4  (via drill 0.6 pad 1.01)
  Top 0.305: v152.4,18.03 R14.1
  Bottom 0.305: JP2.31 111.76,30.48 123.7,30.48 127.51,26.67 JP5.4 149.86,26.67 152.4,24.13 v152.4,18.03
LED5  (via drill 0.6 pad 1.01)
  Top 0.305: v157.46,17.99 R15.1 | JP2.29 110.49,32 111.51,33.02 123.19,33.02 127,29.21 JP5.5
  Bottom 0.305: JP5.5 154.94,29.21 157.48,26.67 157.48,18.01 v157.46,17.99
LED6  (via drill 0.6 pad 1.01)
  Top 0.305: v162.56,18 R16.1
  Bottom 0.305: JP2.18 117.86,46.99 119.13,45.72 119.13,39.62 127,31.75 JP5.6 160.02,31.75 162.56,29.21 v162.56,18
LED7  (via drill 0.6, 0.6 pad 1.01)
  Top 0.305: v167.64,18.03 R5.1 | JP2.22 v124.97,41.91
  Bottom 0.305: v124.97,41.91 124.97,36.83 127.51,34.29 JP5.7 165.1,34.29 167.64,31.75 v167.64,18.03
LED8  (via drill 0.6 pad 1.01)
  Top 0.305: v172.69,18.06 R6.1 | JP2.23 111.76,40.64 125.48,40.64 126.75,39.37 JP5.9
  Bottom 0.305: JP5.9 170.18,39.37 172.72,36.83 172.72,18.09 v172.69,18.06
LED9  (via drill 0.6 pad 1.01)
  Top 0.305: v177.79,18.05 R7.1 | JP2.21 110.49,42.16 111.51,43.18 125.73,43.18 127,41.91 JP5.10
  Bottom 0.305: JP5.10 175.26,41.91 177.8,39.37 177.8,18.06 v177.79,18.05
LED10  (via drill 0.6 pad 1.01)
  Top 0.305: v182.88,17.99 R8.1 | JP2.19 110.49,44.96 111.25,45.72 125.98,45.72 127.25,44.45 JP5.11
  Bottom 0.305: JP5.11 180.34,44.45 182.88,41.91 v182.88,17.99
LED11  (via drill 0.6 pad 1.01)
  Top 0.305: v187.96,17.99 R9.1
  Bottom 0.305: JP2.33 106.68,26.67 106.68,46.99 108.2,48.26 126.49,48.26 128.02,46.99 JP5.12 185.42,46.99 187.96,44.45 v187.96,17.99
MIXER_CLK
  Top 0.406: X20.P 64.1,246.71 R32.1
N$1
  Top 0.305: U4.1 71.55,164.79 R24.2 R23.1 71.82,165.32 71.83,169.49 71.83,202.06 63.5,210.31 51.56,210.31 49.28,212.6 49.28,233.93 43.18,240.03 40.88,240.03 C11.2
N$2
  Top 0.305: U3.8 U3.7 108.72,111.15 110.19,111.15 110.74,111.51 C10.1 110.86,114.55 R10.1
N$3
  Top 0.813: PAD7.1 F1.1
N$4  (via drill 0.6 pad 1.01)
  Top 0.813: F1.2 12.7,238 v14.22,236.47
  Bottom 0.813: v14.22,236.47 14.22,232.41 12.95,231.14 S1.2
N$6
  Top 0.305: U4.24 141.21,172.49 140.72,172.97 78.99,172.97 77.98,173.99 77.98,211.33 48.26,241.05 48.26,244.81
  Top 0.406: 48.26,244.81 C13.2
N$7
  Top 0.813: PAD5.1 15.46,220.44 16,220.98 F2.1
N$8
  Top 0.813: 110.1,6.66 R2.E R1.1
N$10
  Top 0.813: PAD10.1 PAD9.1
N$12
  Top 0.305: R31.2 160.91,181.2 159.33,179.65 147.9,179.65 147.07,178.49 U4.15
N$17
  Top 0.305: R25.2 101.4,179.8 102.62,178.82 141.99,178.82 143.15,177.42 143.15,170.51 U4.21
N$19
  Top 0.813: LED5.A R9.2
N$20
  Top 0.813: LED4.A R8.2
N$21
  Top 0.813: LED3.A R7.2
N$22
  Top 0.813: LED2.A R6.2
N$23
  Top 0.813: LED1.A R5.2
N$24
  Top 0.813: LED11.A R16.2
N$25
  Top 0.305: R26.2 116.08,181.1 116.84,180.34 143.26,180.34 144.27,179.07 144.45,170.48 U4.19
N$26
  Top 0.305: 131.09,183.13 R27.2 131.06,182.23 131.57,181.86 144.27,181.86 145.11,180.85 145.11,170.3 U4.18
N$27
  Top 0.305: R28.2 175.82,169.57 174.24,167.89 146.33,167.89 145.11,166.68 145.11,164.94 U4.7
N$28
  Top 0.305: R29.2 190.78,168.73 189.33,166.32 145.75,166.37 U4.8
N$29
  Top 0.305: U4.16 146.41,183.29 R30.2
N$30
  Top 0.813: LED10.A R15.2
N$31  (via drill 0.6)
  Top 0.406: U4.11 147.71,162.94 149.02,161.59 v153.06,161.59 | v83.41,222.91 64.26,242.06 64.26,244.75 R32.2
  Bottom 0.406: v153.06,161.59 153.06,195.35 151.59,196.99 85.99,197.02 83.41,199.57 v83.41,222.91
N$32  (via drill 0.6)
  Top 0.406: R33.2 79.15,241.65 v90.63,230.15 | v155.19,163.58 148.36,163.55 148.36,164.78 U4.12
  Bottom 0.406: v90.63,230.15 90.68,204.83 94.05,201.33 153.84,201.3 155.19,199.97 v155.19,163.58
N$33
  Top 0.813: LED9.A 152.4,14.09 152.4,14.22 R14.2
N$34
  Top 0.813: LED8.A R13.2
N$35
  Top 0.813: LED7.A R12.2
N$36
  Top 0.813: LED6.A R11.2
PLL_CLK9
  Top 0.406: X9.P 79.18,246.64 R33.1
PLL_CLKIN  (via drill 0.6 pad 1.01)
  Top 0.305: 37.24,240.12 v37.15,240.12 37.13,240.12 37.13,240.11 37.16,240.08 37.2,240.08 | 37.2,240.08 37.22,240.08 37.22,240.04 37.15,240.04 37.15,240.06 37.08,240.06 37.08,240.04 37.27,240.04 37.27,240.06 37.24,240.06 37.2,240.08
  Top 0.61: 37.16,240.08 C11.1
  Bottom 0.61: JP6.2 v37.15,240.12
PLL_SCL  (via drill 0.6)
  Top 0.305: 102.23,110.16 98.98,110.16 98.18,109.59 v97.54,109.59 | 97.03,109.59 R3.1 | U3.3 102.23,110.16 | 102.23,110.16 103,110.16 | U4.22 142.49,175.51 141.22,176.78 v97.54,176.78
  Top 0.406: v97.54,109.59 97.03,109.59
  Bottom 0.406: v97.54,176.78 v97.54,109.59
PLL_SDA  (via drill 0.6)
  Top 0.305: C9.1 R4.1 90.54,109.47 92.46,109.47 92.96,108.97 92.96,107.7 93.22,107.44 99.82,107.44 | v99.95,107.57 100.58,108.2 100.58,109.22 100.88,109.52 U3.4 | U4.23 141.85,173.87 140.97,174.75 v100.58,174.75
  Top 0.406: v99.95,107.57 99.82,107.44
  Bottom 0.406: v100.58,174.75 100.58,108.2 v99.95,107.57
PLL_XOUT
  Top 0.406: X25.P 48.19,246.68 C13.1
S0
  Top 0.305: U4.2 141.85,162.43 140.59,161.14 140.56,157.59 R21.1
  Top 0.813: R22.2 R21.1
SCL1  (via drill 0.6 pad 1.01)
  Top 0.254: 115.26,110.24 115.06,109.98
  Top 0.305: 115.06,109.98 115.16,110.08 R18.1 114.99,110.17 U3.6 108.4,110.11 106.93,110.11 106.68,109.73 106.68,63.25 v107.7,62.23
  Bottom 0.305: JP2.5 v107.7,62.23
SCL2  (via drill 0.6 pad 1.01)
  Top 0.305: v104.06,36.38 107.76,36.38 v107.83,36.31
  Bottom 0.305: JP4.3 102.87,81.28 104.14,80.01 104.03,36.41 v104.06,36.38 | v107.83,36.31 108.28,36.31 109.02,35.57 111.75,35.57 JP2.28
SDA1  (via drill 0.6 pad 1.01)
  Top 0.305: U3.5 108.6,109.53 110.72,109.53 111.25,108.97 111.25,106.17 111.81,105.61 R17.1 115.06,105.6 115.06,103.89 107.7,96.52 107.7,65.28 v108.2,64.77
  Bottom 0.305: JP2.3 v108.2,64.77
SDA2  (via drill 0.6, 0.6 pad 1.01)
  Top 0.406: v107.83,34.27 98.87,34.27 v96.52,36.83
  Bottom 0.406: JP2.27 v107.83,34.27 | v96.52,36.83 96.52,82.55 97.79,83.82 JP4.2
TXCO_10M
  Bottom 0.813: JP6.1 33.3,234.41 $3_194_$_2015-06-18_19-54-36.RF_OUT
VCC_5V  (via drill 0.6, 0.6 pad 1.01)  (1 unrouted)
  Top 0.305: 58.13,118.73 U2.3
  Top 0.406: U2.3 U2.4
  Top 0.813: C5.1 C2.1 21.57,230.79 21.57,226.21 C1.1 F2.2 | C3.1 58.13,118.73 | 48.51,118.36 48.51,105.16 48.77,104.9 55.26,104.9 C4.1 55.62,104.78 U1.4 | U1.4 U1.3 | v58.42,100.84 58.5,101.02 U1.4 | v129.54,73.66 JP3.1
  Top 1.016: F2.2 21.72,214 v21.59,213.87 | v48.01,118.36 48.51,118.36 55.89,118.34 C3.1 | v24.94,226.01 21.77,226.01 C1.1
  Bottom 0.254: 21.47,126.47 PAD3.1
  Bottom 0.813: v58.42,100.84 v100.33,100.84 v100.33,88.9 | v100.33,88.9 127,88.9 129.54,85.6 v129.54,73.66 | v100.33,88.9 JP4.1
  Bottom 1.016: v21.59,213.87 21.59,126.75 | 21.32,126.76 PAD3.1 44.69,126.76 48.01,121.67 v48.01,118.36 | PAD1.1 21.47,126.47 | $3_194_$_2015-06-18_19-54-36.VCC 43.85,229.12 42.22,226.01 v24.94,226.01
VCC_12V
  Top 0.813: C14.1 11,220.9 PAD8.1
  Bottom 1.016: JP1.1 JP1.2 5.08,229.29 5.7,228.67 10.09,228.67 S1.3 10.16,221.78 PAD8.1 11.02,213.66 C6.+
VCTR
  Top 0.305: U4.4 143.16,159.87 143.76,159.26 143.76,157.6 R19.1
  Top 0.813: R20.2 R19.1
VDD_1.8V  (via drill 0.6, 0.8)
  Top 0.305: U3.2 102.67,110.82 99.06,110.82 98.41,111.39 R3.2 R4.2
  Top 0.406: U1.5 U1.6 63.48,105.53 | U4.3 142.5,149.11 v142.49,149.1 | v84.81,104.1 84.77,104.1 84.55,104.32 | U4.13 149.58,170.46 v149.86,170.18
  Top 0.61: 68.7,105.54 C8.1
  Top 0.813: R1.2 v91.95,6.54 | v91.69,98.55 91.69,100.08 v84.81,104.1 84.55,104.32 83.31,105.41 81.53,105.41 | 81.03,105.41 68.58,105.41 68.7,105.54 | 81.53,105.41 81.03,105.41 | 81.03,105.41 81.53,105.66 | 81.53,105.41 81.53,105.66 | 81.53,105.66 81.53,109.47 83.96,111.39 R4.2
  Top 1.016: 63.48,105.53 C8.1
  Bottom 0.813: v91.95,6.54 v91.69,98.55 | v84.81,104.1 85.86,102.87 121.41,102.87 142.49,126.24 v142.49,149.1 149.86,149.1 v149.86,170.18
VDD_3.3V  (via drill 0.6)
  Top 0.305: 144.46,162.38 U4.6 144.45,164.89 144.45,167.39 145.75,168.62 U4.17 | 144.46,162.38 144.46,162.31 145.54,161.29 | 144.46,162.38 145.54,161.29 | 145.54,161.29 v145.54,159 | R10.2 116.84,115.45 116.84,110.74 116.87,114.52 R18.2 116.84,110.56 116.84,105.16 116.87,110.78 R17.2 | U4.10 147.06,163.33 147.07,161.29 145.54,161.29
  Top 0.406: U2.5 63.42,118.62 U2.6
  Top 0.813: C12.1 R19.2 145.54,157.62 v145.54,159 | R21.2 138.8,159.14 v138.94,159.26 133.6,159.26 v123.19,151.13 | v123.19,118.36 120.14,114.55 R10.2 116.72,117.97 115.57,118.87 68.7,118.87
  Top 1.016: R23.2 71.82,160.97 68.58,159.26 C7.1 | 68.7,118.87 C7.1 | C7.1 63.42,118.75 63.42,118.62
  Bottom 0.813: v138.94,159.26 145.54,159.26 v145.54,159 | v123.19,118.36 v123.19,151.13

### Text on the board
tSilk: Hydra SDR Receiver / by NO1D 2015